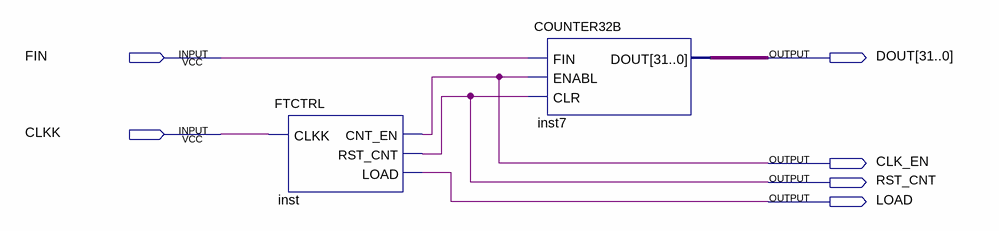
[diagram p0: schematic sheet]
// Quartus schematic 6-4.bdf as structural Verilog: 2 symbols, 6 pins
module \6-4  (
  input  FIN,
  input  CLKK,
  output [31:0] DOUT,
  output CLK_EN,
  output RST_CNT,
  output LOAD
);

  FTCTRL inst (.CLKK(CLKK), .CNT_EN(CLK_EN), .RST_CNT(RST_CNT), .LOAD(LOAD));
  COUNTER32B inst7 (.FIN(FIN), .ENABL(CLK_EN), .CLR(RST_CNT), .DOUT(DOUT));
endmodule
